# EAGLE schematic ESP (EAGLE 7.3.0)
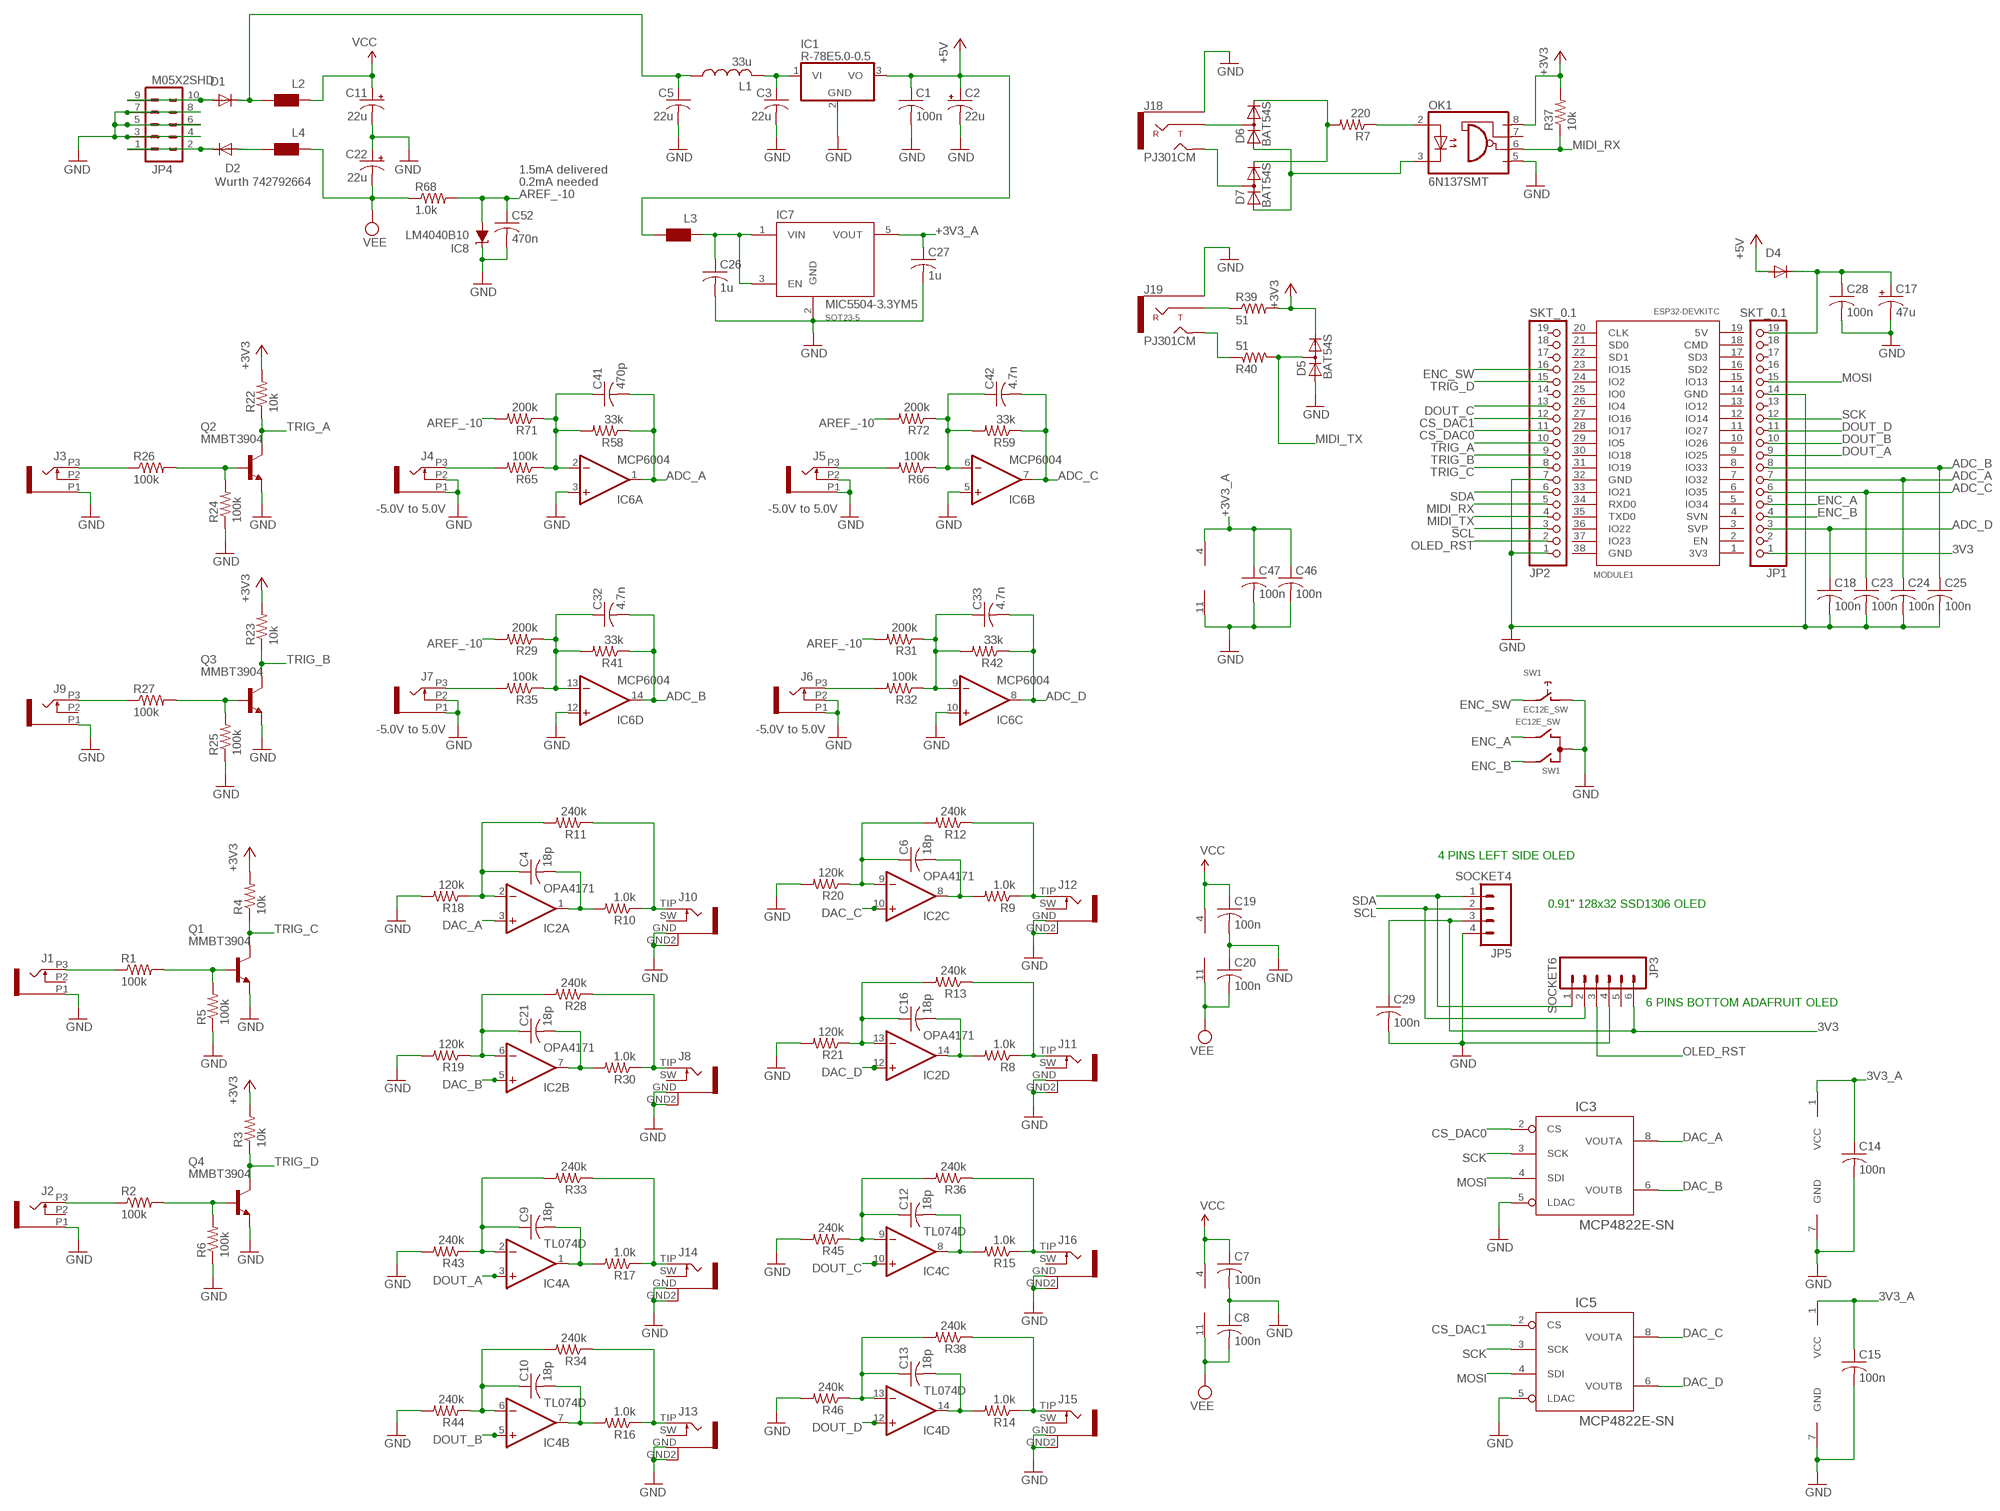
[diagram p0: schematic, sheet 1]

## Parts
C1  100n  C-USC0402  [C0402]
C2  22u  CPOL-USC  [PANASONIC_C]
C3  22u  C-USC1206  [C1206]
C4  18p  C-USC0603  [C0603]
C5  22u  C-USC1206  [C1206]
C6  18p  C-USC0603  [C0603]
C7  100n  C-USC0603  [C0603]
C8  100n  C-USC0603  [C0603]
C9  18p  C-USC0603  [C0603]
C10  18p  C-USC0603  [C0603]
C11  22u  CPOL-USC  [PANASONIC_C]
C12  18p  C-USC0603  [C0603]
C13  18p  C-USC0603  [C0603]
C14  100n  C-USC0603  [C0603]
C15  100n  C-USC0603  [C0603]
C16  18p  C-USC0603  [C0603]
C17  47u  CPOL-USD  [PANASONIC_D]
C18  100n  C-USC0402  [C0402]
C19  100n  C-USC0603  [C0603]
C20  100n  C-USC0603  [C0603]
C21  18p  C-USC0603  [C0603]
C22  22u  CPOL-USC  [PANASONIC_C]
C23  100n  C-USC0402  [C0402]
C24  100n  C-USC0402  [C0402]
C25  100n  C-USC0402  [C0402]
C26  1u  C-USC0603  [C0603]
C27  1u  C-USC0603  [C0603]
C28  100n  C-USC0402  [C0402]
C29  100n  C-USC0603  [C0603]
C32  4.7n  C-USC0402  [C0402]
C33  4.7n  C-USC0402  [C0402]
C41  470p  C-USC0402  [C0402]
C42  4.7n  C-USC0402  [C0402]
C46  100n  C-USC0402  [C0402]
C47  100n  C-USC0402  [C0402]
C52  470n  C-USC0402  [C0402]
D1  1N5819HW  DIODE-SOD123  [SOD123]
D2  1N5819HW  DIODE-SOD123  [SOD123]
D4  1N5819HW  DIODE-SOD123  [SOD123]
D5  BAT54S  DIODE_2CACA-SOT23  [SOT23]
D6  BAT54S  DIODE_2CACA-SOT23  [SOT23]
D7  BAT54S  DIODE_2CACA-SOT23  [SOT23]
IC1  R-78E5.0-0.5  WE173950378  [WE78]
IC2  OPA4171  TL074D  [SO14]
IC3  MCP4822E-SN  [SOIC-8]
IC4  TL074D  [SO14]
IC5  MCP4822E-SN  [SOIC-8]
IC6  MCP6004  TL074PW  [TSSOP14_065]
IC7  MIC5504-3.3YM5  MIC550X-YM5  [SOT23-5-DBV]
IC8  LM4040B10  LM4041B12DBZ  [DBZ_R-PDSO-G3]
J1  PJ301_THONKICONN6  [WQP_PJ_301M6]
J2  PJ301_THONKICONN6  [WQP_PJ_301M6]
J3  PJ301_THONKICONN6  [WQP_PJ_301M6]
J4  PJ301_THONKICONN6  [WQP_PJ_301M6]
J5  PJ301_THONKICONN6  [WQP_PJ_301M6]
J6  PJ301_THONKICONN6  [WQP_PJ_301M6]
J7  PJ301_THONKICONN6  [WQP_PJ_301M6]
J8  PJ301WQP  [WQP_PJ_301BM]
J9  PJ301_THONKICONN6  [WQP_PJ_301M6]
J10  PJ301WQP  [WQP_PJ_301BM]
J11  PJ301WQP  [WQP_PJ_301BM]
J12  PJ301WQP  [WQP_PJ_301BM]
J13  PJ301WQP  [WQP_PJ_301BM]
J14  PJ301WQP  [WQP_PJ_301BM]
J15  PJ301WQP  [WQP_PJ_301BM]
J16  PJ301WQP  [WQP_PJ_301BM]
J18  PJ301CM  [PJ301CM]
J19  PJ301CM  [PJ301CM]
JP1  SKT_0.1  PINHD-1X19  [1X19]
JP2  SKT_0.1  PINHD-1X19  [1X19]
JP3  SOCKET6  M06RA  [MOLEX-1X6-RA]
JP4  M05X2SHD  [2X5-SHROUDED]
JP5  SOCKET4  M04PTH  [1X04]
L1  33u  L-USL2012C  [L2012C]
L2  WE-CBF_0603  [0603]
L3  WE-CBF_0603  [0603]
L4  WE-CBF_0603  [0603]
MODULE1  ESP32DEVKITC  [ESP32-DEVKITC]
OK1  6N137SMT  [DIL8-SMD]
Q1  MMBT3904  MMBT3904LT1-NPN-SOT23-BEC  [SOT23-BEC]
Q2  MMBT3904  MMBT3904LT1-NPN-SOT23-BEC  [SOT23-BEC]
Q3  MMBT3904  MMBT3904LT1-NPN-SOT23-BEC  [SOT23-BEC]
Q4  MMBT3904  MMBT3904LT1-NPN-SOT23-BEC  [SOT23-BEC]
R1  100k  R-US_R0402  [R0402]
R2  100k  R-US_R0402  [R0402]
R3  10k  R-US_R0402  [R0402]
R4  10k  R-US_R0402  [R0402]
R5  100k  R-US_R0402  [R0402]
R6  100k  R-US_R0402  [R0402]
R7  220  R-US_R0603  [R0603]
R8  1.0k  R-US_R0603  [R0603]
R9  1.0k  R-US_R0603  [R0603]
R10  1.0k  R-US_R0603  [R0603]
R11  240k  R-US_R0603  [R0603]
R12  240k  R-US_R0603  [R0603]
R13  240k  R-US_R0603  [R0603]
R14  1.0k  R-US_R0603  [R0603]
R15  1.0k  R-US_R0603  [R0603]
R16  1.0k  R-US_R0603  [R0603]
R17  1.0k  R-US_R0603  [R0603]
R18  120k  R-US_R0603  [R0603]
R19  120k  R-US_R0603  [R0603]
R20  120k  R-US_R0603  [R0603]
R21  120k  R-US_R0603  [R0603]
R22  10k  R-US_R0402  [R0402]
R23  10k  R-US_R0402  [R0402]
R24  100k  R-US_R0402  [R0402]
R25  100k  R-US_R0402  [R0402]
R26  100k  R-US_R0402  [R0402]
R27  100k  R-US_R0402  [R0402]
R28  240k  R-US_R0603  [R0603]
R29  200k  R-US_R0402  [R0402]
R30  1.0k  R-US_R0603  [R0603]
R31  200k  R-US_R0402  [R0402]
R32  100k  R-US_R0402  [R0402]
R33  240k  R-US_R0603  [R0603]
R34  240k  R-US_R0603  [R0603]
R35  100k  R-US_R0402  [R0402]
R36  240k  R-US_R0603  [R0603]
R37  10k  R-US_R0603  [R0603]
R38  240k  R-US_R0603  [R0603]
R39  51  R-US_R0603  [R0603]
R40  51  R-US_R0603  [R0603]
R41  33k  R-US_R0402  [R0402]
R42  33k  R-US_R0402  [R0402]
R43  240k  R-US_R0603  [R0603]
R44  240k  R-US_R0603  [R0603]
R45  240k  R-US_R0603  [R0603]
R46  240k  R-US_R0603  [R0603]
R58  33k  R-US_R0402  [R0402]
R59  33k  R-US_R0402  [R0402]
R65  100k  R-US_R0402  [R0402]
R66  100k  R-US_R0402  [R0402]
R68  1.0k  R-US_R0402  [R0402]
R71  200k  R-US_R0402  [R0402]
R72  200k  R-US_R0402  [R0402]
SW1  EC12E_SW  [ALPS_EC12E_SW]

## Nets
3V3: C29.1 JP1.1 JP3.6 JP5.3
3V3_A: C14.1 C15.1 IC3.1(VCC) IC5.1(VCC)
+3V3: D5.2(C) OK1.8(VCC) R3.2 R4.2 R22.2 R23.2 R37.2 R39.2
+3V3_A: C27.1 C46.1 C47.1 IC6.4(P:V+) IC7.5(VOUT)
+5V: C1.1 C2.+ D4.A IC1.3(VO) L3.2
ADC_A: C24.1 C41.2 IC6.1(A:OUT) JP1.7 R58.1
ADC_B: C25.1 C32.2 IC6.14(D:OUT) JP1.8 R41.1
ADC_C: C23.1 C42.2 IC6.7(B:OUT) JP1.6 R59.1
ADC_D: C18.1 C33.2 IC6.8(C:OUT) JP1.3 R42.1
AREF_-10: C52.1 IC8.2(A) R29.2 R31.2 R68.2 R71.2 R72.2
CS_DAC0: IC3.2(CS) JP2.11
CS_DAC1: IC5.2(CS) JP2.12
DAC_A: IC2.3(A:+IN) IC3.8(VOUTA)
DAC_B: IC2.5(B:+IN) IC3.6(VOUTB)
DAC_C: IC2.10(C:+IN) IC5.8(VOUTA)
DAC_D: IC2.12(D:+IN) IC5.6(VOUTB)
DOUT_A: IC4.3(A:+IN) JP1.9
DOUT_B: IC4.5(B:+IN) JP1.10
DOUT_C: IC4.10(C:+IN) JP2.13
DOUT_D: IC4.12(D:+IN) JP1.11
ENC_A: JP1.5 SW1.B
ENC_B: JP1.4 SW1.A
ENC_SW: JP2.16 SW1.E
GND: C1.2 C2.- C3.2 C5.2 C7.2 C8.1 C11.- C14.2 C15.2 C17.- C18.2 C19.2 C20.1 C22.+ C23.2 C24.2 C25.2 C26.2 C27.2 C28.2 C29.2 C46.2 C47.2 C52.2 D5.1(A) IC1.2(GND) IC3.5(LDAC) IC3.7(GND) IC5.5(LDAC) IC5.7(GND) IC6.3(A:+IN) IC6.5(B:+IN) IC6.10(C:+IN) IC6.11(P:V-) IC6.12(D:+IN) IC7.2(GND) IC8.1(C) J1.P1 J2.P1 J3.P1 J4.P1 J4.P2 J5.P1 J5.P2 J6.P1 J6.P2 J7.P1 J7.P2 J8.GND J8.GND2 J9.P1 J10.GND J10.GND2 J11.GND J11.GND2 J12.GND J12.GND2 J13.GND J13.GND2 J14.GND J14.GND2 J15.GND J15.GND2 J16.GND J16.GND2 J18.P$1(EARTH) J19.P$1(EARTH) JP1.14 JP2.1 JP2.7 JP3.4 JP4.3 JP4.4 JP4.5 JP4.6 JP4.7 JP4.8 JP5.4 OK1.5(GND) Q1.E Q2.E Q3.E Q4.E R5.1 R6.1 R18.2 R19.2 R20.2 R21.2 R24.1 R25.1 R43.2 R44.2 R45.2 R46.2 SW1.C SW1.D
MIDI_RX: JP2.5 OK1.6(VO) R37.1
MIDI_TX: D5.3(AC) JP2.4 R40.2
MORPH_IN1: J7.P3 R35.2
MORPH_IN3: J4.P3 R65.2
MORPH_IN5: J6.P3 R32.2
MORPH_IN6: J5.P3 R66.2
MOSI: IC3.4(SDI) IC5.4(SDI) JP1.15
N$1: J3.P3 R26.1
N$2: J19.P$2(RING) R39.1
N$3: D6.3(AC) J18.P$2(RING)
N$4: C26.1 IC7.1(VIN) IC7.3(EN) L3.1
N$5: C41.1 IC6.2(A:-IN) R58.2 R65.1 R71.1
N$6: C5.1 D1.C L1.1 L2.2
N$7: D7.3(AC) J18.P$3(TIP)
N$8: D6.2(C) D7.2(C) R7.2
N$10: D2.A L4.2
N$11: J1.P3 R1.1
N$12: C17.+ C28.1 D4.C JP1.19
N$15: C42.1 IC6.6(B:-IN) R59.2 R66.1 R72.1
N$17: J2.P3 R2.1
N$21: Q1.B R1.2 R5.2
N$22: Q4.B R2.2 R6.2
N$23: D6.1(A) D7.1(A) OK1.3(C)
N$25: J19.P$3(TIP) R40.1
N$27: C32.1 IC6.13(D:-IN) R29.1 R35.1 R41.2
N$31: C33.1 IC6.9(C:-IN) R31.1 R32.1 R42.2
N$32: C3.1 IC1.1(VI) L1.2
N$36: J9.P3 R27.1
N$39: OK1.2(A) R7.1
N$40: C21.2 IC2.7(B:OUT) R30.2
N$41: C6.2 IC2.8(C:OUT) R9.2
N$42: C16.2 IC2.14(D:OUT) R8.2
N$43: J10.TIP R10.1 R11.1
N$46: J12.TIP R9.1 R12.1
N$47: C4.2 IC2.1(A:OUT) R10.2
N$48: J11.TIP R8.1 R13.1
N$50: Q2.B R24.2 R26.2
N$52: Q3.B R25.2 R27.2
N$54: C16.1 IC2.13(D:-IN) R13.2 R21.1
N$56: D1.A JP4.9 JP4.10
N$64: D2.C JP4.1 JP4.2
N$67: C6.1 IC2.9(C:-IN) R12.2 R20.1
N$68: C21.1 IC2.6(B:-IN) R19.1 R28.2
N$69: C4.1 IC2.2(A:-IN) R11.2 R18.1
N$70: J8.TIP R28.1 R30.1
N$71: C9.2 IC4.1(A:OUT) R17.2
N$72: C10.2 IC4.7(B:OUT) R16.2
N$73: C12.2 IC4.8(C:OUT) R15.2
N$74: C13.2 IC4.14(D:OUT) R14.2
N$75: J14.TIP R17.1 R33.1
N$76: J16.TIP R15.1 R36.1
N$77: J15.TIP R14.1 R38.1
N$78: C13.1 IC4.13(D:-IN) R38.2 R46.1
N$79: C12.1 IC4.9(C:-IN) R36.2 R45.1
N$80: C10.1 IC4.6(B:-IN) R34.2 R44.1
N$81: C9.1 IC4.2(A:-IN) R33.2 R43.1
N$82: J13.TIP R16.1 R34.1
OLED_RST: JP2.2 JP3.3
SCK: IC3.3(SCK) IC5.3(SCK) JP1.12
SCL: JP2.3 JP3.2 JP5.2
SDA: JP2.6 JP3.1 JP5.1
TRIG_A: JP2.10 Q2.C R22.1
TRIG_B: JP2.9 Q3.C R23.1
TRIG_C: JP2.8 Q1.C R4.1
TRIG_D: JP2.15 Q4.C R3.1
VCC: C7.1 C11.+ C19.1 IC2.4(P:V+) IC4.4(P:V+) L2.1
VEE: C8.2 C20.2 C22.- IC2.11(P:V-) IC4.11(P:V-) L4.1 R68.1
Unconnected: J1.P2 J2.P2 J3.P2 J8.SW J9.P2 J10.SW J11.SW J12.SW J13.SW J14.SW J15.SW J16.SW JP1.2 JP1.13 JP1.16 JP1.17 JP1.18 JP2.14 JP2.17 JP2.18 JP2.19 JP3.5 MODULE1.1(3V3) MODULE1.2(EN) MODULE1.3(SVP) MODULE1.4(SVN) MODULE1.5(IO34) MODULE1.6(IO35) MODULE1.7(IO32) MODULE1.8(IO33) MODULE1.9(IO25) MODULE1.10(IO26) MODULE1.11(IO27) MODULE1.12(IO14) MODULE1.13(IO12) MODULE1.14(GND) MODULE1.15(IO13) MODULE1.16(SD2) MODULE1.17(SD3) MODULE1.18(CMD) MODULE1.19(5V) MODULE1.20(CLK) MODULE1.21(SD0) MODULE1.22(SD1) MODULE1.23(IO15) MODULE1.24(IO2) MODULE1.25(IO0) MODULE1.26(IO4) MODULE1.27(IO16) MODULE1.28(IO17) MODULE1.29(IO5) MODULE1.30(IO18) MODULE1.31(IO19) MODULE1.32(GND) MODULE1.33(IO21) MODULE1.34(RXD0) MODULE1.35(TXD0) MODULE1.36(IO22) MODULE1.37(IO23) MODULE1.38(GND) OK1.7(VE) SW1.GND1(G) SW1.GND2(G)

## Notes on the sheet
- 1.5mA delivered
- Wurth 742792664 | 0.2mA needed
- -5.0V to 5.0V | -5.0V to 5.0V
- -5.0V to 5.0V | -5.0V to 5.0V
- 4 PINS LEFT SIDE OLED
- 0.91" 128x32 SSD1306 OLED
- 6 PINS BOTTOM ADAFRUIT OLED

## Library data of the parts
C1 C3-C10 C12-C16 C18-C21 C23-C29 C32 C33 C41 C42 C46 C47 C52 = rcl:C-US: CAPACITOR, American symbol
C2 C11 C17 C22 = rcl:CPOL-US: POLARIZED CAPACITOR, American symbol
D1 D2 D4 = diode:DIODE-: DIODE
D5-D7 = diode:DIODE_2CACA-: 2 Diodes - Cathode-Anode|Cathode-Anode
IC1 = og-vreg:WE173950378
IC2 IC4 = gm-ics:TL074: OP AMP
IC3 IC5 = dac:MCP4*2: DAC 8BIT DUAL SPI/VREF
IC6 = og-linear:TL074: OP AMP
IC7 = borkedlabs-powerics:MIC550X; PACKAGE: SOT23-5
IC8 = texas:LM4041: PRECISION MICROPOWER SHUNT VOLTAGE REFERENCE Source: http://focus.ti.com/lit/ds/slcs146e/slcs146e.pdf; MPN: LM4041B12IDBZR; OC_FARNELL: 1575212; OC_NEWARK: 58K5882
J1-J7 J9 = og-pj301:PJ301_THONKICONN
J8 J10-J16 = og-pj301:PJ301
J18 J19 = pj301cm:PJ301CM
JP1 JP2 = relswitch:PINHD-1X19: PIN HEADER
JP3 = SparkFun-Connectors:M06: Header 6 Standard 6-pin 0.1" header. Use with straight break away headers (SKU : PRT-00116), right angle break away headers (PRT-00553), swiss pins (PRT-00743), machine pins (PRT-00117), and female headers (PRT-00115). Molex polarized connector foot print use with SKU : PRT-08094 with associated crimp pins and housings. NOTES ON THE VARIANTS LOCK and LOCK_LONGPADS... This footprint was designed to help hold the alignment of a through-hole component (i.e. 6-pin header) while soldering it into place. You may notice that each hole has been shifted either up or down by 0.005 of an inch from it's more standard position (which is a perfectly straight line). This slight alteration caused the pins (the squares in the middle) to touch the edges of the holes. Because they are alternating, it causes a "brace" to hold the component in place. 0.005 has proven to be the perfect amount of "off-center" position when using our standard breakaway headers. Although looks a little odd when you look at the bare footprint, once you have a header in there, the alteration is very hard to notice. Also,if you push a header all the way into place, it is covered up entirely on the bottom side. This idea of altering the position of holes to aid alignment will be further integrated into the Sparkfun Library for other footprints. It can help hold any component with 3 or more connection pins.
JP4 = og-header:M05X2: Header 5x2 Standard 10-pin dual row 0.1" header. Commonly used with AVR-ISP. Use with Spark Fun Electronics SKU: PRT-00778
JP5 = SparkFun-Connectors:M04: Header 4 Standard 4-pin 0.1" header. Use with straight break away headers (SKU : PRT-00116), right angle break away headers (PRT-00553), swiss pins (PRT-00743), machine pins (PRT-00117), and female headers (PRT-00115). Molex polarized connector foot print use with SKU : PRT-08231 with associated crimp pins and housings. 1MM SMD Version SKU: PRT-10208
L1 = og-rcl:L-US
L2-L4 = wuerth-elektronik:WE-CBF: SMD EMI Suppression Ferrite Beads - excellent anti-EMI properties - low DCR - impedances till 3000 ohms - rated current up to 6 A
MODULE1 = relswitch:ESP32DEVKITC
OK1 = og-optocouplers:6N137: MOTOROLA OPTO COUPLER
Q1-Q4 = transistor:*-NPN-: NPN Transistror BF959 corrected 2008.03.06
R1-R46 R58 R59 R65 R66 R68 R71 R72 = rcl:R-US_: RESISTOR, American symbol
SW1 = og-encoder:EC12E_SW: ALPS rotary Encoder EC12E series with switch